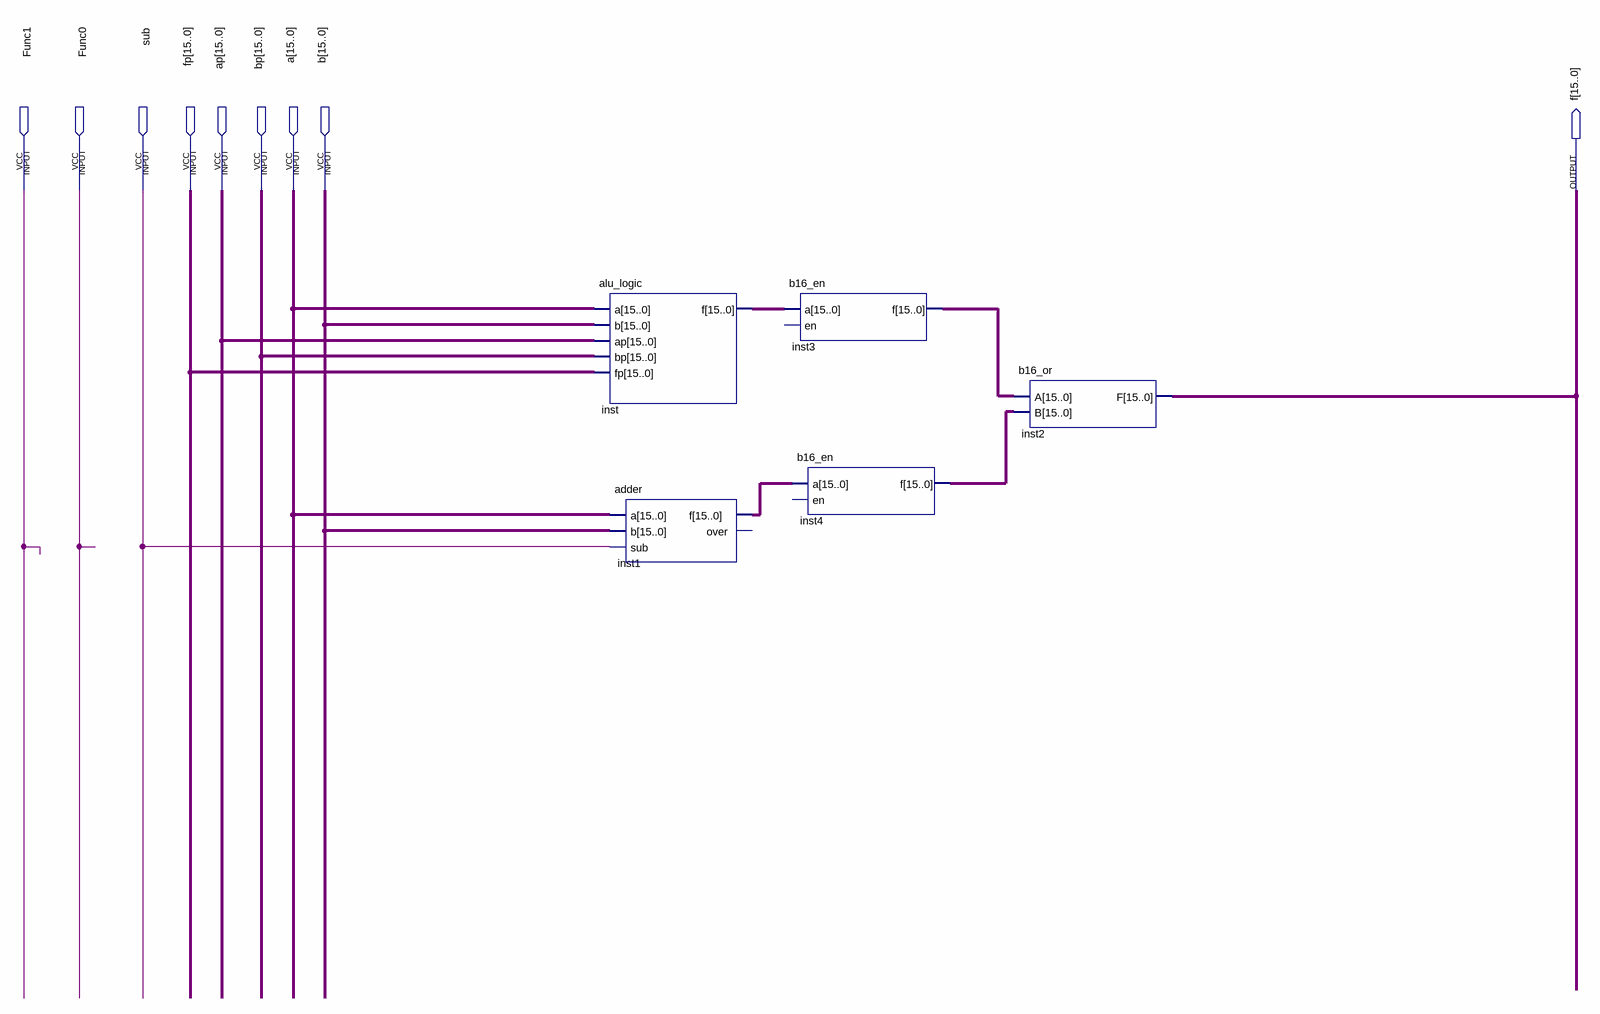
[diagram p0: schematic sheet]
// Quartus schematic alu.bdf as structural Verilog: 5 symbols, 9 pins
module alu (
  input  Func1,
  input  Func0,
  input  sub,
  input  [15:0] fp,
  input  [15:0] ap,
  input  [15:0] bp,
  input  [15:0] a,
  input  [15:0] b,
  output [15:0] f
);

  wire [15:0] inst1_f, inst3_f, inst4_f, inst_f;

  alu_logic inst (.a(a), .b(b), .ap(ap), .bp(bp), .fp(fp), .f(inst_f));
  adder inst1 (.a(a), .b(b), .sub(sub), .f(inst1_f));  // open: over
  b16_en inst3 (.a(inst_f), .f(inst3_f));  // open: en
  b16_en inst4 (.a(inst1_f), .f(inst4_f));  // open: en
  b16_or inst2 (.A(inst3_f), .B(inst4_f), .F(f));
endmodule
